# Altium project OLED_PCB_Dual_Rev1_1.PrjPCB
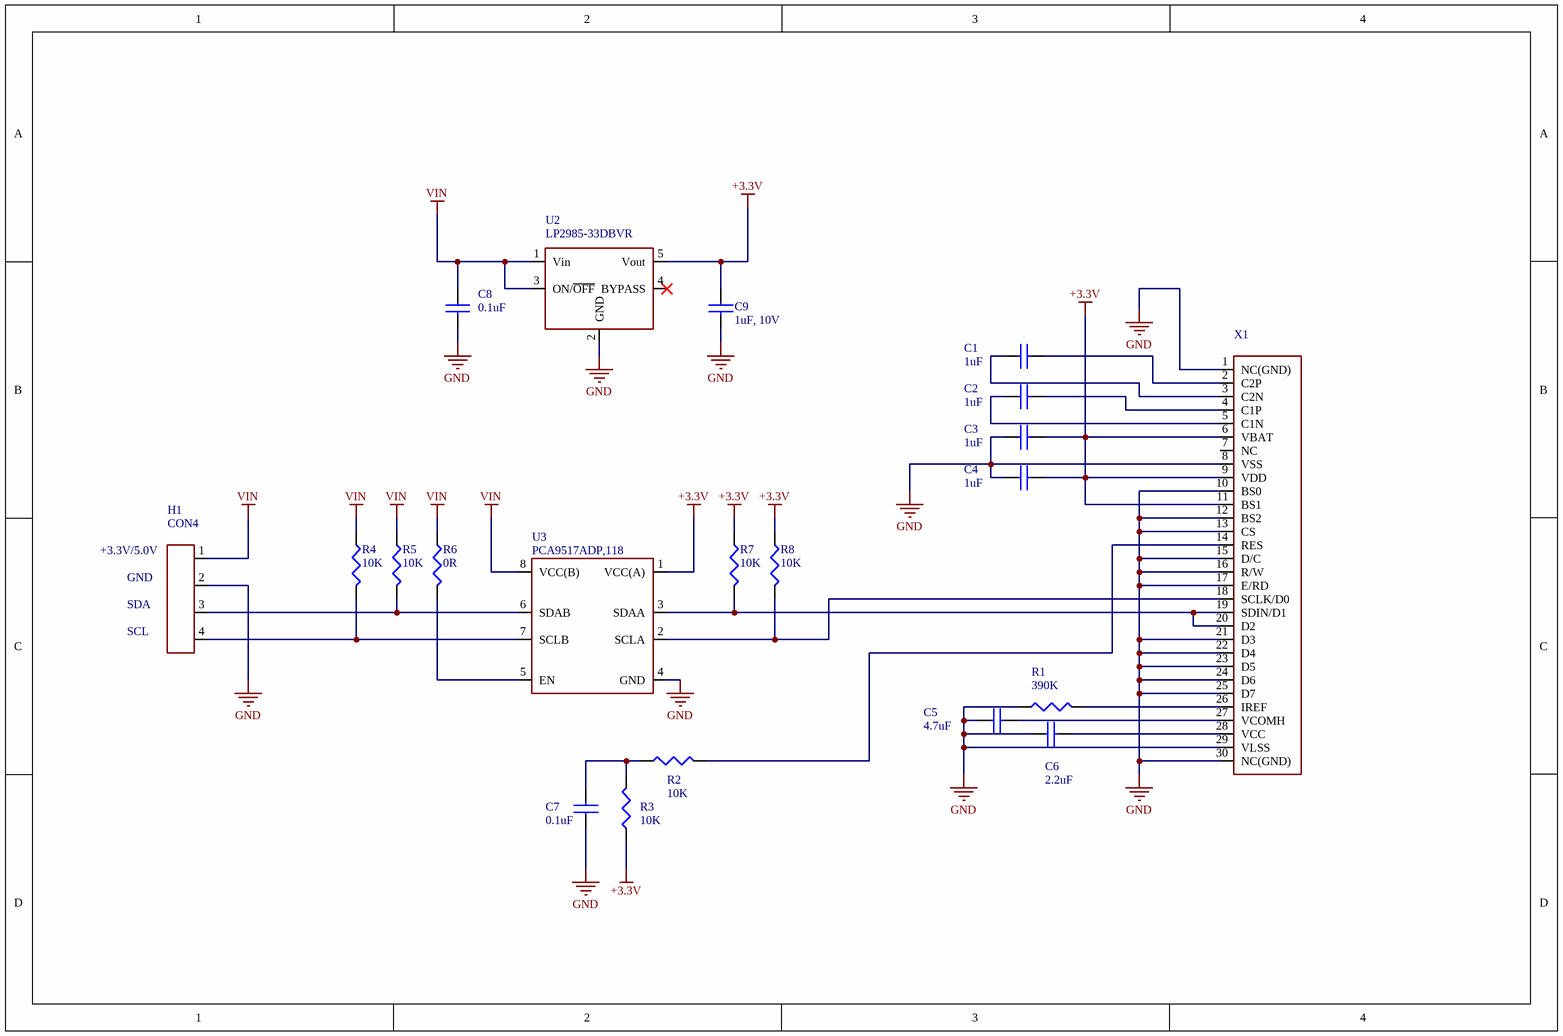
[diagram p0: OLED_PCB_Dual_Rev1_1.SchDoc]
PrjCustomer: Tindie; PrjDrawnBy: MAR; PrjEngineer: MAR; PrjRevision: Rev 1.1; PrjStartDate: 2013/05/24; PrjTitle: OLED; PrjTitle2: 3.3V-5.0V OLED
1 sheet, 21 parts. Net scope: global (net labels, ports and power ports of the same name join across sheets).
Board file: OLED_PCB_Dual_Rev1_1.PcbDoc

## Sheet OLED_PCB_Dual_Rev1_1.SchDoc
size A4; CompanyName: OMNITECH ELECTRONICS INCORPORATED; Organization: Omnitech Electronics Inc.; Address1: 1-10 Akerley Blvd, Dartmouth, Nova Scotia, Canada B3B 1J4; Address2: (902) 468-5911, FAX (902) 468-5912; Address3: www.omnitechelectronics.ca; SheetTotal: 5; PageSetup: Record=PageOptions|CenterHorizontal=True|CenterVertical=True|PrintScale=0.67|XCorrection=1.00|YCorrection=1.00|PrintKind=1|BorderSize=5000000|LeftOffset=0|BottomOffset=0|Orientation=2|PaperLength=1000|PaperWidth=1000|Scale=100|PaperSource=15|PrintQuality=600|MediaType=1|DitherType=10|PaperKind=11x17|PrintScaleMode=1

### Parts
C1  1uF  [CAPC1608X90N]
C2  1uF  [CAPC1608X90N]
C3  1uF  [CAPC1608X90N]
C4  1uF  [CAPC1608X90N]
C5  4.7uF  [CAPC1608X90N]
C6  2.2uF  [CAPC1608X90N]
C7  0.1uF  [CAPC1608X90N]
C8  0.1uF  [CAPC1608X90N]
C9  1uF, 10V  [CAPC1608X90N]
H1  CON4  [HDR1X4-Empty]
R1  390K  [RESC1608X55N]
R2  10K  [RESC1608X55N]
R3  10K  [RESC1608X55N]
R4  10K  [RESC1608X55N]
R5  10K  [RESC1608X55N]
R6  0R  [RESC1608X55N]
R7  10K  [RESC1608X55N]
R8  10K  [RESC1608X55N]
U2  LP2985-33DBVR  [SOT95P280X144-5N]
U3  PCA9517ADP,118  [TSOP65P490X110-8N]
X1  OLED_GLASS  [OLED_GLASS]  (value not drawn)

### Nets
+3.3V: C3.2 C4.2 C9.1 R3.1 R7.1 R8.1 U2.5(Vout) U3.1(VCC(A)) X1.6(VBAT) X1.9(VDD) X1.11(BS1)
GND: C3.1 C4.1 C5.1 C6.1 C7.1 C8.2 C9.2 H1.2 R1.1 U2.2(GND) U3.4(GND) X1.1(NC(GND)) X1.8(VSS) X1.10(BS0) X1.12(BS2) X1.13(CS) X1.15(D/C) X1.16(R/W) X1.17(E/RD) X1.21(D3) X1.22(D4) X1.23(D5) X1.24(D6) X1.25(D7) X1.29(VLSS) X1.30(NC(GND))
VIN: C8.1 H1.1 R4.1 R5.1 R6.1 U2.1(Vin) U2.3(ON/~{OFF}) U3.8(VCC(B))
NetC1_1: C1.1 X1.3(C2N)
NetC1_2: C1.2 X1.2(C2P)
NetC2_1: C2.1 X1.5(C1N)
NetC2_2: C2.2 X1.4(C1P)
NetC5_2: C5.2 X1.27(VCOMH)
NetC6_2: C6.2 X1.28(VCC)
NetC7_2: C7.2 R2.1 R3.2
NetH1_3: H1.3 R5.2 U3.6(SDAB)
NetH1_4: H1.4 R4.2 U3.7(SCLB)
NetR1_2: R1.2 X1.26(IREF)
NetR2_2: R2.2 X1.14(RES)
NetR6_2: R6.2 U3.5(EN)
NetR7_2: R7.2 U3.3(SDAA) X1.19(SDIN/D1) X1.20(D2)
NetR8_2: R8.2 U3.2(SCLA) X1.18(SCLK/D0)

Not connected (* = marked no-connect by the designer): U2 4(BYPASS)*; X1 7(NC)

### Notes on the sheet
- (near H1) +3.3V/5.0V
- (near H1) GND
- (near H1) SDA
- (near H1) SCL

### Library data of the parts
C1-C8 = CAP_0603: CAP 0603
  C1-C4: Value: 1uF
  C5: Value: 4.7uF
  C6: Value: 2.2uF
  C7 C8: Value: 0.1uF
C9 = C1608X7R1A105K: CAP CER 1UF 10V 10% X7R 0603; Manufacturer: TDK Corp; Order Part Number: 445-5138-1-ND; Available From: Digikey; Data Sheet: http://www.tdk.com/pdf/general_B11.pdf; Exact Part Number: C1608X7R1A105K; Operating Temp: -55 to +125; Price: $0.083; ROHS Compliant: Yes; Voltage/Pwr: 10V
H1 = CON4: CONN HEADER 4POS .100" PADS; PartNumber: PADS
R1-R8 = RES_0603: RES 0603
  R1: Value: 390K
  R2-R5 R7 R8: Value: 10K
  R6: Value: 0R
U2 = LP2985-33DBVR: IC REG LDO 3.3V .15A SOT23-5; Manufacturer: Texas Instruments; PartNumber: LP2985-33DBVR
U3 = PCA9517ADP,118: IC I2C BUS REPEATER 8-TSSOP; Manufacturer: Maxim; PartNumber: PCA9517ADP,118; Value: PCA9517ADP,118
X1 = OLED_GLASS: PartNumber: N/A; Manufacturer: N/A